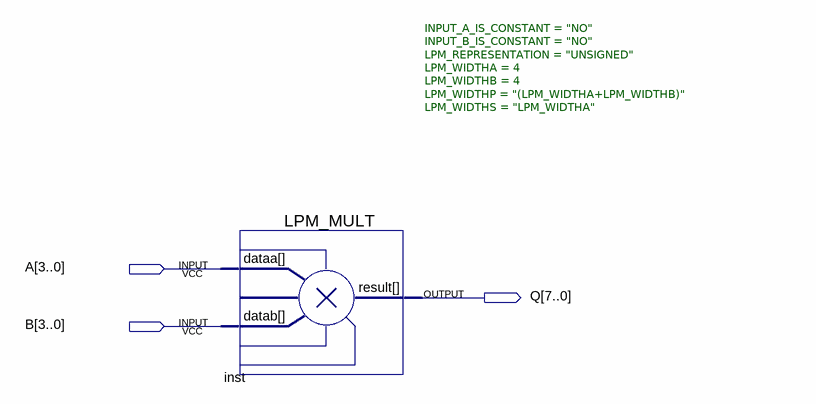
[diagram p0: schematic sheet]
// Quartus schematic p_8.bdf as structural Verilog: 1 symbols, 3 pins
module p_8 (
  input  [3:0] A,
  input  [3:0] B,
  output [7:0] Q
);

  LPM_MULT #(.INPUT_A_IS_CONSTANT("NO"), .INPUT_B_IS_CONSTANT("NO"), .LPM_REPRESENTATION("UNSIGNED"), .LPM_WIDTHA(4), .LPM_WIDTHB(4), .LPM_WIDTHP("(LPM_WIDTHA+LPM_WIDTHB)"), .LPM_WIDTHS("LPM_WIDTHA")) inst (
    .dataa(A), .datab(B), .result(Q));
endmodule
